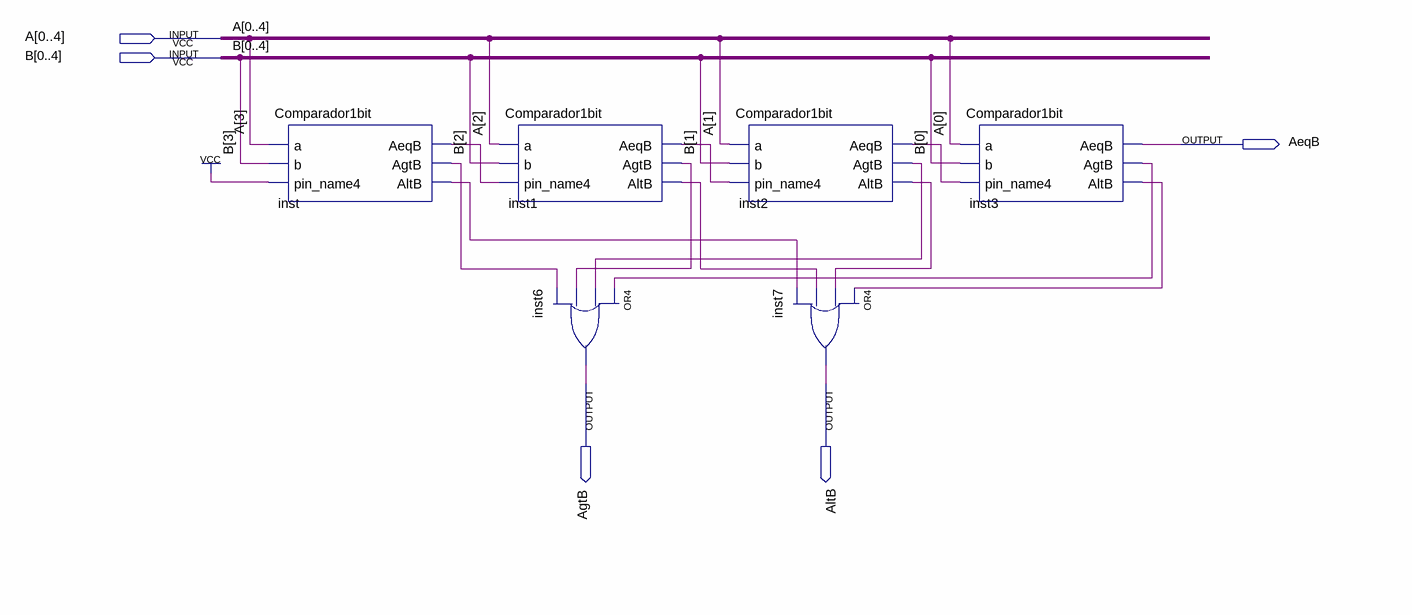
[diagram p0: schematic sheet]
// Quartus schematic Comparador4bits.bdf as structural Verilog: 6 symbols, 5 pins
module Comparador4bits (
  input  [0:4] A,
  input  [0:4] B,
  output AeqB,
  output AgtB,
  output AltB
);

  wire inst1_aeqb, inst1_agtb, inst1_altb, inst2_aeqb, inst2_agtb, inst2_altb, inst3_agtb, inst3_altb,
       inst_aeqb, inst_agtb, inst_altb;

  Comparador1bit inst (.a(A[3]), .b(B[3]), .pin_name4(1'b1), .AeqB(inst_aeqb), .AgtB(inst_agtb), .AltB(inst_altb));
  Comparador1bit inst1 (
    .a(A[2]), .b(B[2]), .pin_name4(inst_aeqb), .AeqB(inst1_aeqb), .AgtB(inst1_agtb), .AltB(inst1_altb));
  or inst6 (AgtB, inst3_agtb, inst2_agtb, inst1_agtb, inst_agtb);
  Comparador1bit inst2 (
    .a(A[1]), .b(B[1]), .pin_name4(inst1_aeqb), .AeqB(inst2_aeqb), .AgtB(inst2_agtb), .AltB(inst2_altb));
  or inst7 (AltB, inst3_altb, inst2_altb, inst1_altb, inst_altb);
  Comparador1bit inst3 (.a(A[0]), .b(B[0]), .pin_name4(inst2_aeqb), .AeqB(AeqB), .AgtB(inst3_agtb), .AltB(inst3_altb));
endmodule
